# Altium schematic sheet OldLED.SchDoc
size A; SheetNumber: 1; SheetTotal: 2
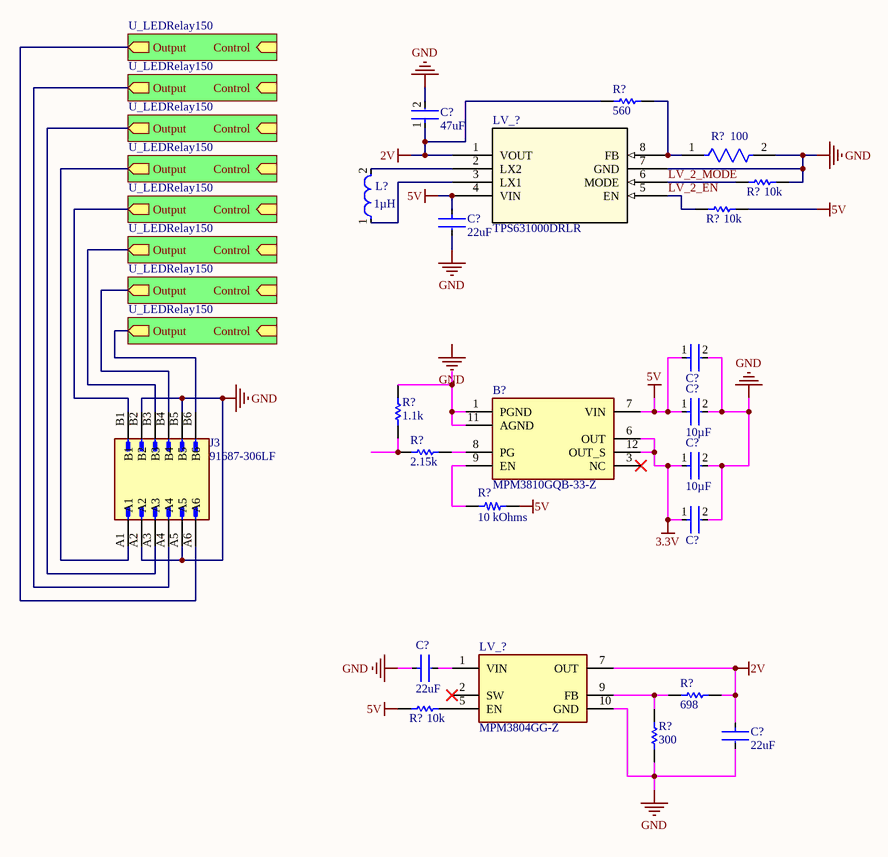
[diagram p0: OldLED.SchDoc]

## Parts
(Parts that share a designator on the sheet are numbered #1, #2 ... from top to bottom, then left to right.)
B?  MPM3810GQB-33-Z  [MPM3810GQB33Z]
C?#1  47uF  [FP-CL31-IPC_C]
C?#2  22uF  [FP-CL31H-0_2-IPC_C]
C?#3  CL10B104JB8NNNC  [FP-CL10-0_1-MFG]  (value not drawn)
C?#4  value 10µF  [FP-CL21-IPC_B]  (hidden comment: CL21A106KOQNNNE)
C?#5  value 10µF  [FP-CL21-IPC_B]  (hidden comment: CL21A106KOQNNNE)
C?#6  CL10B104JB8NNNC  [FP-CL10-0_1-MFG]  (value not drawn)
C?#7  22uF  [FP-CL31H-0_2-IPC_C]
C?#8  22uF  [FP-CL31H-0_2-IPC_C]
J3  91687-306LF  [AMPHENOL_91687-306LF]
L?  value 1µH  [FP-DFE252012C-IPC_C]  (hidden comment: DFE252012P-1R0M=P2)
LV_?#1  TPS631000DRLR  [TPS631000DRLR_TEX]
LV_?#2  MPM3804GG-Z  [MPM3804GGZ]
R?#1  value 560  [RESC2013X60X40LL20T25]  (hidden comment: ERA-6AEB561V)
R?#2  value 100  [FP-ERJ6EN-MFG]  (hidden comment: ERJ-6ENF1000V)
R?#3  10k  [RESC1609X55X30ML15T15]
R?#4  10k  [RESC1609X55X30ML15T15]
R?#5  value 1.1k  [RESC1608X55X30LL15T15]  (hidden comment: ERJ-3EKF1101V)
R?#6  value 2.15k  [RESC2013X70X40NL20T20]  (hidden comment: ERJ-6ENF2151V)
R?#7  value 10 kOhms  [RES 0805_2012]  (hidden comment: ERJ-6ENF1002V)
R?#8  value 698  [RESC2013X70X40NL20T20]  (hidden comment: ERJ-6ENF6980V)
R?#9  10k  [RESC1609X55X30ML15T15]
R?#10  value 300  [RES 0805_2012]  (hidden comment: ERJ-6ENF3000V)

## Sub-sheets
U_LEDRelay150 = LEDRelay150.SchDoc: Control (in), Output (out)
U_LEDRelay150 = LEDRelay150.SchDoc: Control (in), Output (out)
U_LEDRelay150 = LEDRelay150.SchDoc: Control (in), Output (out)
U_LEDRelay150 = LEDRelay150.SchDoc: Control (in), Output (out)
U_LEDRelay150 = LEDRelay150.SchDoc: Control (in), Output (out)
U_LEDRelay150 = LEDRelay150.SchDoc: Control (in), Output (out)
U_LEDRelay150 = LEDRelay150.SchDoc: Control (in), Output (out)
U_LEDRelay150 = LEDRelay150.SchDoc: Control (in), Output (out)

## Nets
2V: C?#1.1 C?#8.1 LV_?#1.1(VOUT) LV_?#2.7(OUT) R?#1.2 R?#8.2
3.3V: B?.6(OUT) B?.12(OUT_S) C?#5.1 C?#6.1
5V: B?.7(VIN) C?#2.1 C?#3.1 C?#4.1 LV_?#1.4(VIN) R?#4.1 R?#7.2 R?#9.2
GND: C?#1.2 C?#2.2 C?#3.2 C?#4.2 C?#5.2 C?#6.2 C?#7.1 C?#8.2 J3.A2 J3.A5 J3.B2 J3.B5 LV_?#1.7(GND) LV_?#2.10(GND) R?#2.2 R?#3.1 R?#10.2
LV_2_EN: LV_?#1.5(EN) R?#4.2
LV_2_MODE: LV_?#1.6(MODE) R?#3.2
NetB?_1: B?.1(PGND) B?.11(AGND) R?#5.2
NetB?_8: B?.8(PG) R?#6.1
NetB?_9: B?.9(EN) R?#7.1
NetC?#7_2: C?#7.2 LV_?#2.1(VIN)
NetJ3_A1: J3.A1 ; sheet U_LEDRelay150/Output
NetJ3_A3: J3.A3 ; sheet U_LEDRelay150/Output
NetJ3_A4: J3.A4 ; sheet U_LEDRelay150/Output
NetJ3_A6: J3.A6 ; sheet U_LEDRelay150/Output
NetJ3_B1: J3.B1 ; sheet U_LEDRelay150/Output
NetJ3_B3: J3.B3 ; sheet U_LEDRelay150/Output
NetJ3_B4: J3.B4 ; sheet U_LEDRelay150/Output
NetJ3_B6: J3.B6 ; sheet U_LEDRelay150/Output
NetL?_1: L?.1 LV_?#1.3(LX1)
NetL?_2: L?.2 LV_?#1.2(LX2)
NetLV_?#1_8: LV_?#1.8(FB) R?#1.1 R?#2.1
NetLV_?#2_5: LV_?#2.5(EN) R?#9.1
NetLV_?#2_9: LV_?#2.9(FB) R?#8.1 R?#10.1
NetR?#5_1: R?#5.1 R?#6.2

Not connected (* = marked no-connect by the designer): B? 3(NC)*; LV_?#2 2(SW)*

## Notes on the sheet
- Labels drawn without touching a wire or pin: GND

## Library data of the parts
B? = CMP-509-000000-4: MPM3810 Series 3.3 V 1.2 A 4200 kHz Synchronous Step-Down Converter - QFN-12; Manufacturer_Name: Monolithic Power Systems (MPS); Operating Supply Current: 17uA; Operating Supply Voltage: 6V; Voltage - Output 1: 3.3V; Geometry.Height: 1mm; Switching Frequency: 3.5MHz; Min Input Voltage: 2.5V; Output Current: 1.2A; Max Power Dissipation: 1.9W; Number of Outputs: 1; Mouser Price/Stock: https://www.mouser.co.uk/ProductDetail/Monolithic-Power-Systems-MPS/MPM3810GQB-33-Z?qs=WskeALMjHsooCNVHuZWMUQ%3D%3D; Min Operating Temperature: -40°C; Height: 0.04inch; Lead Free: Lead Free; Series: -; Design Item ID: MPM3810GQB-33-Z; Max Operating Temperature: 125°C; Package Quantity: 5000; Output Voltage: 3.3V; Source: MPM3810GQB-33-Z.SchLib; Mounting Technology: Surface Mount; Max Supply Voltage: 6V; Weight: 0.000776oz; Pins: 12; Radiation Hardening: No; Mouser Part Number: 946-MPM3810GQB-33-Z; Packaging: Tape and Reel; Case/Package: QFN; Manufacturer_Part_Number: MPM3810GQB-33-Z; Datasheet Link: https://www.monolithicpower.com/pub/media/document/MPM3810_r1.1.pdf; Max Output current: 1.2A; Features: UVLO,OCP,OTP; Length: 0.12inch; Width: 0.1inch
C?#1 = CMP-001-00091-1: Cap Ceramic 47uF 10V X5R 20% SMD 1206 85°C Embossed Plastic T/R
C?#2 C?#7 C?#8 = CMP-001-00087-1: Ceramic capacitor SMD 1206 - 22uF/25V X5R# K +-10% Samsung, RoHS
C?#3 C?#6 = CMP-13271-000011-1: CAP CER 0.1UF 50V X7R 0603; Manufacturer: Samsung Electro-Mechanics America, Inc; Value: 100nF; Material: Ceramic; Temperature Coefficient: 15%; Tolerance: 5%; Ipc Land Pattern Name: CAPC16080X80; Device Class L1: Passive Components; Digikey Description: CAP CER 0.1UF 50V X7R 0603; Voltage Rating: 50V; Height: 0.9mm; ComponentLink2Description: Datasheet; Device Class L2: Capacitors; ComponentLink2URL: http://www.samsungsem.com/kr/support/product-search/mlcc/__icsFiles/afieldfile/2019/06/18/CL10B104JB8NNNC-19.pdf; Temperature Characteristic: X7R; Temperature Range High: +125°C; Lead Free: Yes; Temperature Range Low: -55°C; Category: Cap; Manufacturer Part Number: CL10B104JB8NNNC; Package: CL10-0.1; Temperature: -55°C to +125°C; Octopart: https://octopart.com/cl10b104jb8nnnc-samsung-9302151; Device Class L3: Ceramic Capacitors; RoHS: TRUE; Automotive: No; Capacitance: 100nF
C?#4 C?#5 = CMP-001-00105-1: -; Voltage: 16V; Tolerance: 10%; Dielectric: X7R; Lead Free: Lead Free; Construction: Flat; Length: 2mm; Min Operating Temperature: -55°C; Height: 1.25mm; RoHS Compliant: Yes; Package Quantity: 1; Max Operating Temperature: 85°C; Packaging: Tape and Reel; Case/Package: 0805; Voltage Rating: 16V; Case Code (Metric): 2012; Voltage Rating (DC): 16V; Mounting Technology: Surface Mount; Series: CL; Radiation Hardening: No; Depth: 1.25mm; Case Code (Imperial): 0805; Width: 0.049inch; Thickness: 0.055inch
J3 = CMP-503-000000-2: Conn Shrouded Header HDR 12 POS 2.54mm Solder ST Thru-Hole Poly Bag; Max Voltage Rating (AC): 1kV; MF: {'manufacturer': u'Amphenol ICC (FCI)'}; Row Spacing: 0.1inch; Connector Type: Male Pin; Number of Contacts: 12; Termination: Solder; Availability: Unavailable; Value: *; Contact Mating Length: 0.197inch; Color: Blue; Pitch: 2.54mm; RoHS Compliant: Yes; Max Operating Temperature: 125°C; Mounting Technology: Through Hole; Price: None; Package Quantity: 500; Packaging: Rail/Tube; Contact Material: Bronze; Contact Plating: Gold,GXT; Depth: 7.8mm; Housing Material: Polyester; Source: 91687-306LF.SchLib; Package: None; Series: DUBOX™, MezzSelect™, Basics+; MP: 91687-306LF; Min Operating Temperature: -40°C; Contact Type: Male Pin; Design Item ID: 91687-306LF; Length: 15.06mm; Number of Rows: 2; Number of Positions: 12; Orientation: Straight; Housing Color: Blue
L? = CMP-006-00030-1: Inductor Power Shielded Wirewound 1uH 20% 1MHz Metal 3.2A 0.042Ohm DCR 1008 T/R; Current Rating: 4.3A; Core Material: Ferrite; DC Resistance (DCR): 42mR; Depth: 2mm; Test Frequency: 1MHz; Resistor Type: Wirewound,Metal Alloy; Shielding: Shielded; Series: DFE252012P; Packaging: Cut Tape; Min Operating Temperature: -40°C; Max DC Current: 3.2A; RoHS Compliant: Yes; Length: 0.098inch; Case/Package: 1008; Mounting Technology: Surface Mount; Max Operating Temperature: 125°C; Width: 0.079inch; Case Code (Imperial): 1008; Height - Seated (Max): 0.039inch; Case Code (Metric): 2520; Tolerance: 20%
LV_?#1 = CMP-512-000000-2: 1.5-A output current, high power density buck-boost converter 8-SOT-5X3 -40 to 125; Mfr_Name: Texas Instruments; Design Item ID: TPS631000DRLR; Manufacturer_Part_Number: TPS631000DRLR; Source: TPS631000DRLR.SchLib; Copyright: Copyright (C) 2023 Ultra Librarian. All rights reserved.; RefDes: RefDes; Type: DEV
LV_?#2 = CMP-00003-2: Non-Isolated PoL Module DC DC Converter 1 Output 1.2V 600mA 2.3V - 5.5V Input; Manufacturer_Name: Monolithic Power Systems (MPS); Number of Outputs: 1; Efficiency: 91%; Geometry.Height: 1mm; Design Item ID: MPM3804GG-Z; Packaging: Cut Tape; Min Operating Temperature: -40°C; Datasheet Link: https://www.monolithicpower.com/DesktopModules/DocumentManage/API/Document/GetDocument?id=4896; Max Supply Voltage: 5.5V; Max Operating Temperature: 125°C; Mouser Price/Stock: https://www.mouser.co.uk/ProductDetail/Monolithic-Power-Systems-MPS/MPM3804GG-Z?qs=HPsBXS2EMdRnCJIKVliqew%3D%3D; Max Output current: 600mA; Mounting Technology: Surface Mount; Voltage - Output 1: 1.2V; Source: MPM3804GG-Z.SchLib; RoHS Compliant: Yes; Mouser Part Number: 946-MPM3804GG-Z; Case/Package: QFN; Manufacturer_Part_Number: MPM3804GG-Z; Min Input Voltage: 2.3V; Series: -
R?#1 = CMP-009-00225-2: Res Thin Film 0805 560 Ohm 0.1% 1/8W ±25ppm/°C Molded SMD SMD Punched Carrier T/R; Power Rating: 125mW; Voltage Rating: 100V; Resistor Type: Thin Film; Termination: Solder; Pins: 2; Military Standard: Not; Max Operating Temperature: 155°C; Construction: Rectangular; Lead Free: Lead Free; Radiation Hardening: No; Reach SVHC Compliant: Yes; Depth: 1.25mm; Case/Package: 0805; Packaging: Tape and Reel; Height: 0.5mm; Package Quantity: 1; Features: Automotive AEC-Q200; Max Power Dissipation: 125mW; Contact Plating: Tin; Mounting Technology: Surface Mount; Technology: METAL FILM; Series: ERA-6A; Temperature Coefficient: 25ppm/°C; Number of Terminations: 2; Tolerance: 0.1%; Case Code (Imperial): 0805; Length: 2mm; Width: 1.25mm; Min Operating Temperature: -55°C; Voltage Rating (DC): 100V; Case Code (Metric): 2012; RoHS Compliant: Yes; Resistance Tolerance: 0.1%
R?#2 = CMP-009-00224-1: Resistor Thick Film 0805 100 Ohm 1% 1/8W 100ppm/C Molded SMD Punched Carrier T/R; Max Power Dissipation: 125mW; Voltage Rating: 150V; Temperature Coefficient: 100ppm/°C; Contact Plating: Tin; Min Operating Temperature: -55°C; Features: Automotive AEC-Q200; Case/Package: 0805; Length: 2mm; Height: 0.6mm; Series: ERJ; Termination: SMD/SMT; Packaging: Tape and Reel; Case Code (Imperial): 0805; Lead Free: Lead Free; Technology: THICK FILM; Tolerance: 1%; Mounting Technology: Surface Mount; Max Operating Temperature: 155°C; Voltage Rating (DC): 150V; Pins: 2; Power Rating: 125mW; Resistance Tolerance: 1%; Military Standard: Not; RoHS Compliant: Yes; Construction: Rectangular; Case Code (Metric): 2012; Package Quantity: 1; Width: 1.2mm; Reach SVHC Compliant: Yes; Depth: 1.25mm; Number of Terminations: 2; Radiation Hardening: No; Resistor Type: Thick Film
R?#3 R?#4 R?#9 = CMP-009-00181-1: Res Thick Film 0603 10K Ohm 1% 1/10W ±100ppm/°C Molded SMD Punched Carrier T/R
R?#5 = CMP-009-00223-1: Res Thick Film 0603 1.1K Ohm 1% 1/10W ±100ppm/°C Molded SMD Punched Carrier T/R; Power Rating: 100mW; Voltage Rating (DC): 75V; Case Code (Metric): 1608; Termination: SMD/SMT; Tolerance: 1%; Construction: Rectangular; Mounting Technology: Surface Mount; Technology: THICK FILM; Max Power Dissipation: 100mW; Case/Package: 0603; Temperature Coefficient: 100ppm/°C; Number of Terminations: 2; Contact Plating: Tin; Radiation Hardening: No; Reach SVHC Compliant: Yes; Lead Free: Lead Free; Series: ERJ; Max Operating Temperature: 155°C; Voltage Rating: 75V; Depth: 0.8mm; Features: Automotive AEC-Q200; Min Operating Temperature: -55°C; Package Quantity: 1; Packaging: Tape and Reel; Width: 0.8mm; Length: 1.6mm; RoHS Compliant: Yes; Case Code (Imperial): 0603; Military Standard: Not; Resistor Type: Thick Film; Resistance Tolerance: 1%; Height: 0.45mm
R?#6 = CMP-009-00220-1: Res Thick Film 0805 2.15K Ohm 1% 1/8W ±100ppm/°C Molded SMD Punched Carrier T/R; Voltage Rating: 150V; Max Power Dissipation: 125mW; Radiation Hardening: No; Technology: THICK FILM; Package Quantity: 1; Mounting Technology: Surface Mount; Packaging: Tape and Reel; Min Operating Temperature: -55°C; Lead Free: Lead Free; Height: 0.6mm; Termination: SMD/SMT; Features: Automotive AEC-Q200; Voltage Rating (DC): 150V; Series: ERJ; Width: 1.2mm; Tolerance: 1%; Number of Terminations: 2; Resistor Type: Thick Film; Case Code (Metric): 2012; Construction: Rectangular; RoHS Compliant: Yes; Resistance Tolerance: 1%; Reach SVHC Compliant: Yes; Length: 2mm; Military Standard: Not; Temperature Coefficient: 100ppm/°C; Max Operating Temperature: 155°C; Contact Plating: Tin; Power Rating: 125mW; Depth: 1.25mm; Height - Seated (Max): 0.028inch; Case/Package: 0805; Case Code (Imperial): 0805
R?#7 = CMP-309-000210-1: RES SMD 10K OHM 1% 1/8W 0805; Manufacturer: Panasonic Electronic Components; Power (Watts): 0.125W, 1/8W; Temperature Coefficient: ±100ppm/°C; Series: ERJ-6EN; ComponentLink2Description: DigiKey Link; Resistance: 10 kOhms; Composition: Thick Film; Features: Automotive AEC-Q200; Lifecycle Status: Active; Device Package: 0805 (2012 Metric); Packaging: TapeAndReel; Height - Seated (Max): 0.028" (0.70mm); ComponentLink2URL: https://www.digikey.com/en/products/detail/panasonic-electronic-components/ERJ-6ENF1002V/111474; Part Number: ERJ-6ENF1002V; PartId: 28130; Number of Terminations: 2; Part Status: Active; Minimum Order: 1; LastUpdated: 9/18/2022 12:42:21 PM; Size / Dimension: 0.079" L x 0.049" W (2.00mm x 1.25mm); Supplier Device Package: 0805; Package / Case: 0805 (2012 Metric); Tolerance: ±1%; Ratings: AEC-Q200; Operating Temperature: -55°C ~ 155°C; Price: 0.01; ComponentLink1Description: Datasheet; ComponentLink1URL: https://industrial.panasonic.com/cdbs/www-data/pdf/RDA0000/AOA0000C304.pdf
R?#8 = CMP-009-00226-1: RES SMD 698 OHM 1% 1/8W 0805; Power Rating: 125mW; Voltage Rating (DC): 150V; Temperature Coefficient: 100ppm/°C; Lead Free: Lead Free; Technology: THICK FILM; Height: 0.6mm; Case Code (Imperial): 0805; Case Code (Metric): 2012; Tolerance: 1%; Features: Automotive AEC-Q200; Mounting Technology: Surface Mount; Termination: SMD/SMT; Package Quantity: 1; RoHS Compliant: Yes; Max Operating Temperature: 155°C; Reach SVHC Compliant: Yes; Military Standard: Not; Case/Package: 0805; Max Power Dissipation: 125mW; Length: 2mm; Depth: 1.25mm; Series: ERJ; Min Operating Temperature: -55°C; Voltage Rating: 150V; Number of Terminations: 2; Packaging: Tape and Reel; Contact Plating: Tin; Resistor Type: Thick Film; Construction: Rectangular; Weight: 0.000194oz; Resistance Tolerance: 1%; Width: 1.2mm
R?#10 = CMP-309-001221-2: Res Thick Film 0805 300 Ohm 1% 0.125W ±100ppm/°C Molded SMD Punched Carrier T/R; Manufacturer: Panasonic Electronic Components; Power Rating: 125mW; Power (Watts): 0.125W, 1/8W; Resistance: 300 Ohms; Voltage Rating: 150V; Size / Dimension: 0.079" L x 0.049" W (2.00mm x 1.25mm); Package Quantity: 1; Case/Package: 0805; Min Operating Temperature: -55°C; Case Code (Imperial): 0805; Lifecycle Status: Active; Width: 1.2mm; Price: 0.01; Temperature Coefficient: 100ppm/°C; Supplier Device Package: 0805; Radiation Hardening: No; Series: ERJ; Ratings: AEC-Q200; PartId: 30178; Military Standard: Not; Length: 2mm; Features: Automotive AEC-Q200; Contact Plating: Tin; Construction: Rectangular; RoHS Compliant: Yes; Case Code (Metric): 2012; Max Operating Temperature: 155°C; Resistor Type: Thick Film; ComponentLink1URL: https://industrial.panasonic.com/cdbs/www-data/pdf/RDA0000/AOA0000C304.pdf; ComponentLink2URL: https://www.digikey.com/en/products/detail/panasonic-electronic-components/ERJ-6ENF3000V/1746484; ComponentLink1Description: Datasheet; Lead Free: Lead Free; Termination: SMD/SMT; Number of Terminations: 2; LastUpdated: 9/18/2022 12:42:15 PM; Voltage Rating (DC): 150V; Package / Case: 0805 (2012 Metric); Composition: Thick Film; Resistance Tolerance: 1%; Reach SVHC Compliant: Yes; Max Power Dissipation: 125mW; Mounting Technology: Surface Mount; Part Number: ERJ-6ENF3000V; Device Package: 0805 (2012 Metric); Part Status: Active; Tolerance: 1%; Packaging: Tape and Reel; Height: 0.028inch; Operating Temperature: -55°C ~ 155°C; Depth: 1.25mm; Height - Seated (Max): 0.028" (0.70mm); ComponentLink2Description: DigiKey Link; Minimum Order: 1